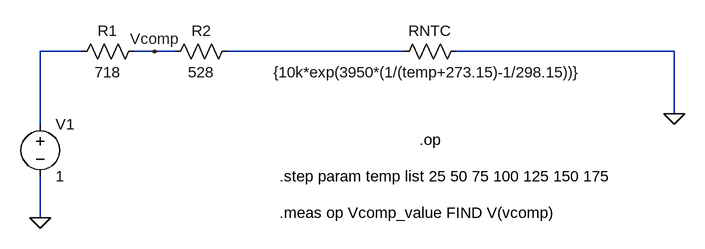
[diagram p0: schematic ntc_compensation.asc]
ntc_compensation.asc, the LTspice schematic file:
Version 4.1
SHEET 1 964 680
WIRE 32 -128 -32 -128
WIRE 144 -128 112 -128
WIRE 176 -128 144 -128
WIRE 528 -128 256 -128
WIRE 944 -128 608 -128
WIRE 944 -32 944 -128
WIRE -32 -16 -32 -128
WIRE -32 128 -32 64
FLAG 944 -32 0
FLAG -32 128 0
FLAG 144 -128 Vcomp
SYMBOL res 128 -144 R90
WINDOW 0 0 56 VBottom 2
WINDOW 3 32 56 VTop 2
SYMATTR InstName R1
SYMATTR Value 718
SYMBOL res 272 -144 R90
WINDOW 0 0 56 VBottom 2
WINDOW 3 32 56 VTop 2
SYMATTR InstName R2
SYMATTR Value 528
SYMBOL res 624 -144 R90
WINDOW 0 0 56 VBottom 2
WINDOW 3 32 56 VTop 2
SYMATTR InstName RNTC
SYMATTR Value {10k*exp(3950*(1/(temp+273.15)-1/298.15))}
SYMBOL voltage -32 -32 R0
WINDOW 123 0 0 Left 0
WINDOW 39 0 0 Left 0
SYMATTR InstName V1
SYMATTR Value 1
TEXT 552 8 Left 2 !.op
TEXT 336 64 Left 2 !.step param temp list 25 50 75 100 125 150 175
TEXT 336 120 Left 2 !.meas op Vcomp_value FIND V(vcomp)

The netlist it stands for:
* ntc_compensation.asc
R1 Vcomp N001 718
R2 N002 Vcomp 528
RNTC 0 N002 {10k*exp(3950*(1/(temp+273.15)-1/298.15))}
V1 N001 0 1
.op
.step param temp list 25 50 75 100 125 150 175
.meas op Vcomp_value FIND V(vcomp)
.backanno
.end